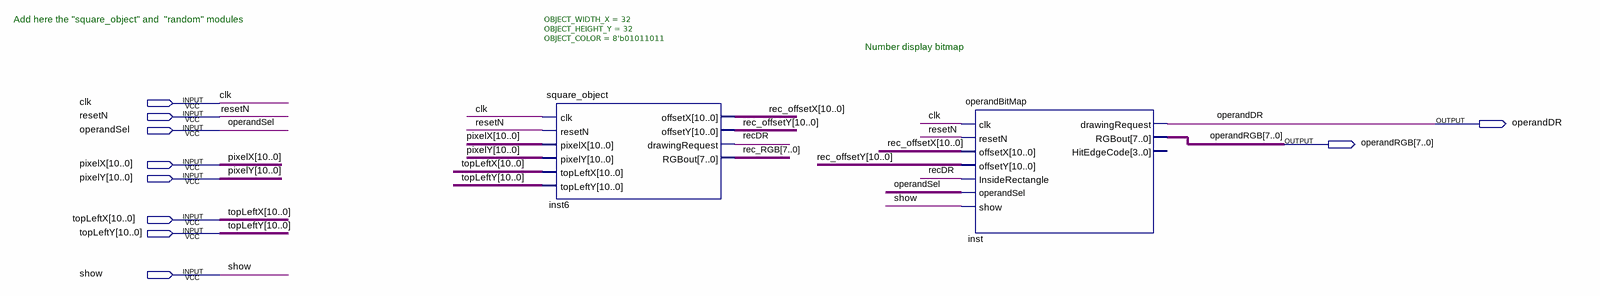
[diagram p0: schematic sheet]
// Quartus schematic OPERAND_DISPLAY.bdf as structural Verilog: 2 symbols, 10 pins
module OPERAND_DISPLAY (
  input  clk,
  input  resetN,
  input  operandSel,
  input  [10:0] pixelX,
  input  [10:0] pixelY,
  input  [10:0] topLeftX,
  input  [10:0] topLeftY,
  input  show,
  output operandDR,
  output [7:0] operandRGB
);

  wire recDR;
  wire [7:0] rec_RGB;
  wire [10:0] rec_offsetX, rec_offsetY;

  square_object #(.OBJECT_WIDTH_X(32), .OBJECT_HEIGHT_Y(32), .OBJECT_COLOR(8'b01011011)) inst6 (
    .clk(clk), .resetN(resetN), .pixelX(pixelX), .pixelY(pixelY), .topLeftX(topLeftX), .topLeftY(topLeftY),
    .offsetX(rec_offsetX), .offsetY(rec_offsetY), .drawingRequest(recDR), .RGBout(rec_RGB));
  operandBitMap inst (
    .clk(clk), .resetN(resetN), .offsetX(rec_offsetX), .offsetY(rec_offsetY), .InsideRectangle(recDR),
    .operandSel(operandSel), .show(show), .drawingRequest(operandDR), .RGBout(operandRGB));  // open: HitEdgeCode

  // Notes on the sheet:
  //   Add here the "square_object" and  "random" modules
  //   Number display bitmap
endmodule
